# Altium schematic sheet gpio.SchDoc: INTERFACES GPIO
size A4; ApprovedBy: Yves Chevallier; CheckedBy: Yves Chevallier; Author: Yves Chevallier; CompanyName: EPFL; DrawnBy: Yves Chevallier; Engineer: Yves Chevallier; Organization: EPFL; Address1: EPFL; Address2: CH1015 Lausanne; Address3: +41(0)21 693 36 98; Address4: +41(0)21 693 26 00; DocumentNumber: ABC.00.0000.000.0; Revision: v1.0; SheetNumber: 0; SheetTotal: 0; DrawnByDate: 2000-01-01; ExecutionWarrantDate: 2000-01-01; ExecutionWarrant: Yves Chevallier; Context: Confidential; PageSetup: Record=PageOptions|CenterHorizontal=True|CenterVertical=False|PrintScale=0.97|XCorrection=1.00|YCorrection=1.00|PrintKind=0|BorderSize=5000000|LeftOffset=0|BottomOffset=0|Orientation=2|PaperLength=1000|PaperWidth=1000|Scale=100|PaperSource=262|PrintQuality=600|MediaType=1|DitherType=10|PaperKind=A4|PrintScaleMode=1; EngineerDate: 2000-01-01; CheckedByDate: 2000-01-01; SVN: OUI; ProjectName: PRJ
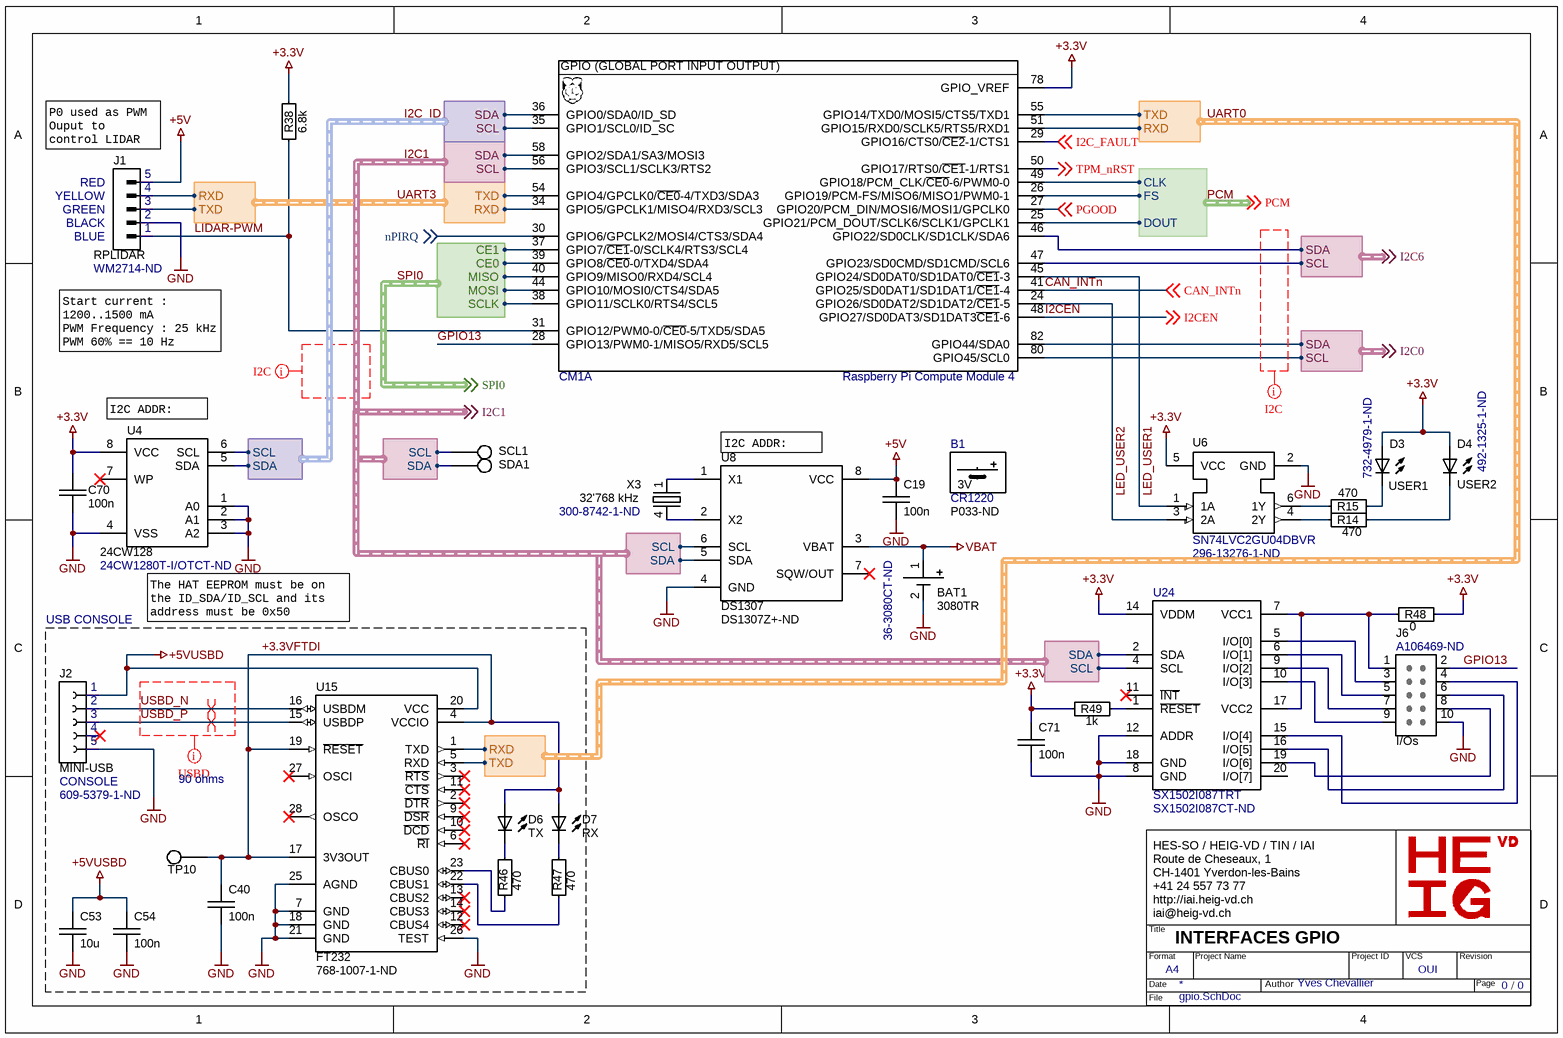
[diagram p0: gpio.SchDoc]

## Parts
B1  CR1220  Supplier Part Number 1: P033-ND  (mechanical)
BAT1  3080TR  Supplier Part Number 1: 36-3080CT-ND  [BAT_BK-916-TR]
C19  100n  [SM/C0603]
C40  100n  [SM/C0603]
C53  10u  [SM/C0805]
C54  100n  [SM/C0603]
C70  100n  [SM/C0603]
C71  100n  [SM/C0603]
CM1  Raspberry Pi Compute Module 4  [CM4-RASPBERRY-PI4]  (part A of 15)
D3  USER1  Supplier Part Number 1: 732-4979-1-ND  [SM/LED0603]
D4  USER2  Supplier Part Number 1: 492-1325-1-ND  [SM/LED0603]
D6  TX  [SM/LED0603]
D7  RX  [SM/LED0603]
J1  RPLIDAR  Supplier Part Number 1: WM2714-ND  [CONN/HEADER/2.54mm/5POS/MOLEX/22122054]
J2  MINI-USB  FUNCTION: CONSOLE  Supplier Part Number 1: 609-5379-1-ND  [AMPHENOL_10118192-0002LF]
J6  I/Os  Supplier Part Number 1: A106469-ND  [HE/2.54/10]
R14  470  [SM/R0603]
R15  470  [SM/R0603]
R38  6.8k  [SM/R0805]
R46  470  [SM/R0805]
R47  470  [SM/R0805]
R48  0  [SM/R0805]
R49  1k  [SM/R0805]
SCL1  TP  [TP/SMALL]  (value not drawn)  (no BOM)
SDA1  TP  [TP/SMALL]  (value not drawn)  (no BOM)
TP10  TP  [TP/SMALL]  (value not drawn)  (no BOM)
U4  24CW128  Supplier Part Number 1: 24CW1280T-I/OTCT-ND  [SOIC8]
U6  SN74LVC2GU04DBVR  Supplier Part Number 1: 296-13276-1-ND  [SOT23-6]
U8  DS1307  Supplier Part Number 1: DS1307Z+-ND  [SOIC8]
U15  FT232  Supplier Part Number 1: 768-1007-1-ND  [SSOP28]
U24  SX1502I087TRT  Supplier Part Number 1: SX1502I087CT-ND  [QFN40P300X300X50_HS-21N]
X3  32'768 kHz  Supplier Part Number 1: 300-8742-1-ND  [CRYSTAL/SMD/ABS25]

## Blocks framed on the sheet
USB CONSOLE: C40 C53 C54 D6 D7 J2 R46 R47 TP10 U15

## Harnesses
I2C: SDA, SCL
UART: TXD, RXD
SPI: CE1, MISO, MOSI, SCLK, CE0
PCM: CLK, FS, DOUT

## Nets
+3.3V: C70.1 C71.1 CM1.78(GPIO_VREF) D3.1 D4.1 R38.2 R48.2 R49.1 U4.8(VCC) U6.5(VCC) U24.14(VDDM)
+5V: C19.1 J1.5 U8.8(VCC)
+5VUSBD: C53.1 C54.1 J2.1 U15.20(VCC)
GND: BAT1.2(-) C19.2 C40.2 C53.2 C54.2 C70.2 C71.2 J1.2 J2.5 J6.10 U4.1(A0) U4.2(A1) U4.3(A2) U4.4(VSS) U6.2(GND) U8.4(GND) U15.7(GND) U15.18(GND) U15.21(GND) U15.25(AGND) U15.26(TEST) U24.8(GND) U24.12(ADDR) U24.18(GND)
VBAT: BAT1.1(+) U8.3(VBAT)
+3.3VFTDI: C40.1 D6.1 D7.1 TP10.1 U15.4(VCCIO) U15.17(3V3OUT) U15.19(~{RESET})
CAN_INTn: CM1.41(GPIO25/SD0DAT1/SD1DAT1/~{CE1}-4) ; off-sheet CAN_INTn
GPIO13: CM1.28(GPIO13/PWM0-1/MISO5/RXD5/SCL5) J6.2
I2C1.SCL: CM1.56(GPIO3/SCL1/SCLK3/RTS2) SCL1.1 U8.6(SCL) U24.4(SCL) ; harness I2C.SCL
I2C1.SDA: CM1.58(GPIO2/SDA1/SA3/MOSI3) SDA1.1 U8.5(SDA) U24.2(SDA) ; harness I2C.SDA
I2C_FAULT: CM1.29(GPIO16/CTS0/~{CE2}-1/CTS1) ; off-sheet I2C_FAULT
I2C_ID.SCL: CM1.35(GPIO1/SCL0/ID_SC) U4.6(SCL) ; harness I2C.SCL
I2C_ID.SDA: CM1.36(GPIO0/SDA0/ID_SD) U4.5(SDA) ; harness I2C.SDA
I2CEN: CM1.48(GPIO27/SD0DAT3/SD1DAT3~{CE1}-6) ; off-sheet I2CEN
LED_USER1: CM1.45(GPIO24/SD0DAT0/SD1DAT0/~{CE1}-3) U6.1(1A)
LED_USER2: CM1.24(GPIO26/SD0DAT2/SD1DAT2/~{CE1}-5) U6.3(2A)
LIDAR-PWM: CM1.31(GPIO12/PWM0-0/~{CE0}-5/TXD5/SDA5) J1.1 R38.1
nPIRQ: CM1.30(GPIO6/GPCLK2/MOSI4/CTS3/SDA4) ; off-sheet nPIRQ
PCM.CLK: CM1.49(GPIO18/PCM_CLK/~{CE0}-6/PWM0-0) ; harness PCM.CLK
PCM.DOUT: CM1.25(GPIO21/PCM_DOUT/SCLK6/SCLK1/GPCLK1) ; harness PCM.DOUT
PCM.FS: CM1.26(GPIO19/PCM-FS/MISO6/MISO1/PWM0-1) ; harness PCM.FS
PGOOD: CM1.27(GPIO20/PCM_DIN/MOSI6/MOSI1/GPCLK0) ; off-sheet PGOOD
SPI0.CE0: CM1.39(GPIO8/~{CE0}-0/TXD4/SDA4) ; harness SPI.CE0
SPI0.CE1: CM1.37(GPIO7/~{CE1}-0/SCLK4/RTS3/SCL4) ; harness SPI.CE1
SPI0.MISO: CM1.40(GPIO9/MISO0/RXD4/SCL4) ; harness SPI.MISO
SPI0.MOSI: CM1.44(GPIO10/MOSI0/CTS4/SDA5) ; harness SPI.MOSI
SPI0.SCLK: CM1.38(GPIO11/SCLK0/RTS4/SCL5) ; harness SPI.SCLK
TPM_nRST: CM1.50(GPIO17/RTS0/~{CE1}-1/RTS1) ; off-sheet TPM_nRST
UART0.RXD: CM1.51(GPIO15/RXD0/SCLK5/RTS5/RXD1) U15.1(TXD) ; harness UART.RXD
UART0.TXD: CM1.55(GPIO14/TXD0/MOSI5/CTS5/TXD1) U15.5(RXD) ; harness UART.TXD
UART3.RXD: CM1.34(GPIO5/GPCLK1/MISO4/RXD3/SCL3) J1.4 ; harness UART.RXD
UART3.TXD: CM1.54(GPIO4/GPCLK0/~{CE0}-4/TXD3/SDA3) J1.3 ; harness UART.TXD
USBD_N: J2.2 U15.16(USBDM)
USBD_P: J2.3 U15.15(USBDP)
NetCM1_46: CM1.46(GPIO22/SD0CLK/SD1CLK/SDA6) ; harness I2C.SDA
NetCM1_47: CM1.47(GPIO23/SD0CMD/SD1CMD/SCL6) ; harness I2C.SCL
NetCM1_80: CM1.80(GPIO45/SCL0) ; harness I2C.SCL
NetCM1_82: CM1.82(GPIO44/SDA0) ; harness I2C.SDA
NetD3_2: D3.2 R15.2
NetD4_2: D4.2 R14.2
NetD6_2: D6.2 R46.2
NetD7_2: D7.2 R47.2
NetJ6_1: J6.1 R48.1 U24.7(VCC1) U24.17(VCC2)
NetJ6_3: J6.3 U24.5(I/O[0])
NetJ6_4: J6.4 U24.15(I/O[4])
NetJ6_5: J6.5 U24.6(I/O[1])
NetJ6_6: J6.6 U24.16(I/O[5])
NetJ6_7: J6.7 U24.9(I/O[2])
NetJ6_8: J6.8 U24.19(I/O[6])
NetJ6_9: J6.9 U24.10(I/O[3])
NetR14_1: R14.1 U6.4(2Y)
NetR15_1: R15.1 U6.6(1Y)
NetR46_1: R46.1 U15.23(CBUS0)
NetR47_1: R47.1 U15.22(CBUS1)
NetR49_2: R49.2 U24.1(~{RESET})
NetU8_1: U8.1(X1) X3.1
NetU8_2: U8.2(X2) X3.4

Not connected (* = marked no-connect by the designer): J2 4*; U4 7(WP)*; U8 7(SQW/OUT)*; U15 2(~{DTR})* 3(~{RTS})* 6(~{RI})* 9(~{DSR})* 10(~{DCD})* 11(~{CTS})* 12(CBUS4)* 13(CBUS2)* 14(CBUS3)* 27(OSCI)* 28(OSCO)*; U24 11(~{INT})* 20(I/O[7])

## Layout directives
differential pair: USBD_N, USBD_P
rule Impedance Constraint [Min = 85.00    Max = 95.00    ]; Impedance: 90 ohms; rule Differential Pairs Routing [Pref Gap = 6.43mil    Min Gap  = 5.906mil    Max Gap  = 6.43milPref Width = 9.048mil    Min Width  = 5.906mil    Max Width  = 9.048mil]; rule Matched Net Lengths [Tolerance = 10mil]: USBD_N, USBD_P
net class I2C: (no net found under the mark)

## Notes on the sheet
- (near J1) P0 used as PWM Ouput to control LIDAR motor speed
- (near J1) RED
- (near J1) YELLOW
- (near J1) GREEN
- (near J1) BLACK
- (near J1) BLUE
- Start current : 1200..1500 mA
  PWM Frequency : 25 kHz
  PWM 60% == 10 Hz
- (near U4) I2C ADDR: 0x50
- (near U8) I2C ADDR: 0x68
- (near U4) The HAT EEPROM must be on the ID_SDA/ID_SCL and its address must be 0x50
- Labels drawn without touching a wire or pin: I2C0, I2C1, I2C6, PCM, SPI0
- HES-SO / HEIG-VD / TIN / IAI
  Route de Cheseaux, 1
  CH-1401 Yverdon-les-Bains
  +41 24 557 73 77
  http://iai.heig-vd.ch
  iai@heig-vd.ch
- Title
- Format
- Date
- A4
- Project Name
- Author
- Project ID
- VCS
- Revision
- Page
- /
- File
- (in symbol CM4, part A) GPIO (GLOBAL PORT INPUT OUTPUT)
- (in symbol CR1220) 3V

## Library data of the parts
B1 = CR1220: Lithum battery (LiCB) / 3V / 40mAh / 12.5 mm / 0.77 g; Supplier 1: Digi-Key
BAT1 = BAT: Supplier 1: Digi-Key
C19 C40 C54 C70 C71 = C: Chip Capacitor; Voltage: 16V; Dielectric: X7R; Supplier 2 Part Number: 1292-1393-1-ND; Supplier 2: Digi-Key
C53 = C: CAP CER 10UF 10V X5R 0805; Supplier 1: Digi-Key; Supplier Part Number 1: 1276-2402-1-ND
CM1 = CM4: Raspberry Pi Compute Module 4 by Amornthep Phunsin
D3 D4 D6 D7 = LED: Supplier 1: Digi-Key
  D6 D7: Supplier Part Number 1: 732-4979-1-ND
J1 = CONN 5 MALE: 0022122054; Supplier 1: Digi-Key
J2 = CONN 5 FEMALE: DEBUG; Supplier 1: Digi-Key
J6 = CONN 10 (2x5): Supplier 1: Digi-Key
R14 R15 R38 R46-R49 = R: Chip Resistor SMD
SCL1 SDA1 TP10 = TP: Test Point
U6 = SN74LVC2GU: IC INVERTER 2CH 2-INP SOT23-6; Supplier 1: Digi-Key
U8 = DS1307: RTC; Supplier 1: Digi-Key
U24 = SX1502I08: IC GPIO EXPANDER I2C 8CH 20QFNI/O Expander 8 I²C 400kHz 20-QFN-UT (3x3); Supplier 1: Digi-Key
X3 = XTAL: CM200C32768HZFT; Supplier 1: Digi-Key
U4 = 24CW128: Supplier 1: Digi-Key
U15 = FT232: Supplier 1: Digi-Key